# EasyEDA Pro project AC Power Switch.eprj, board Single Port PCB
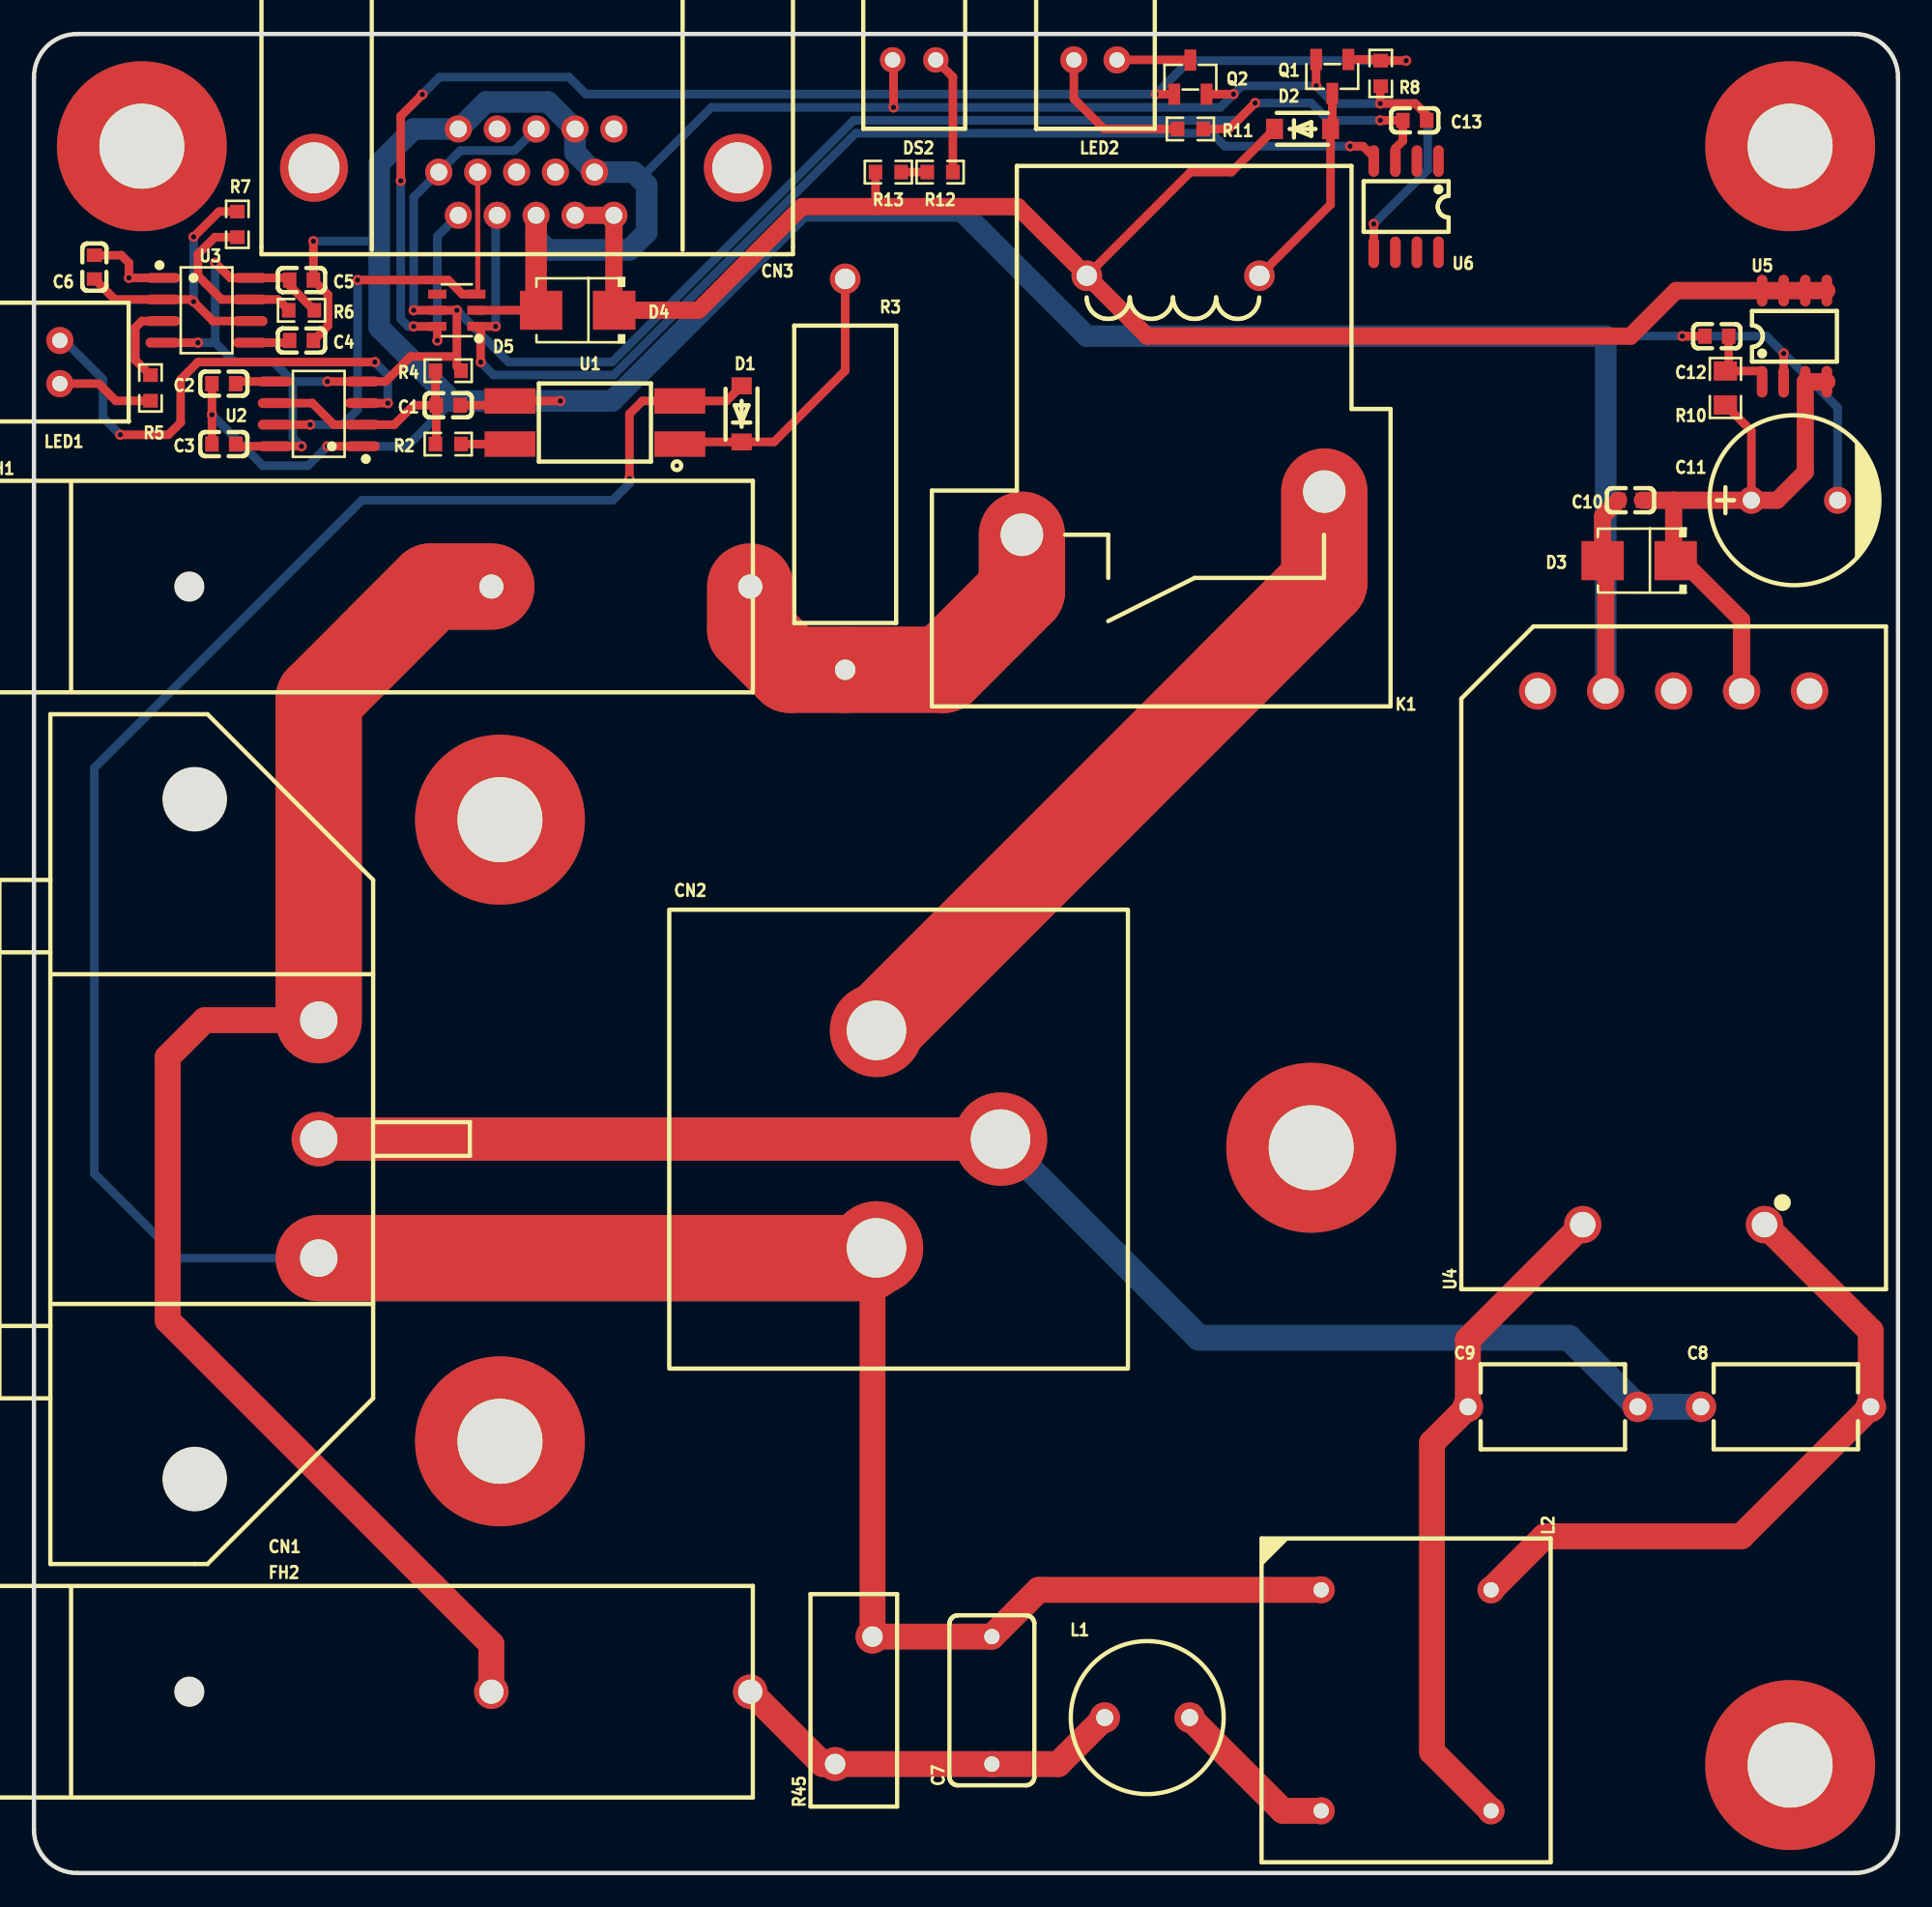
[diagram p5: board, top side]
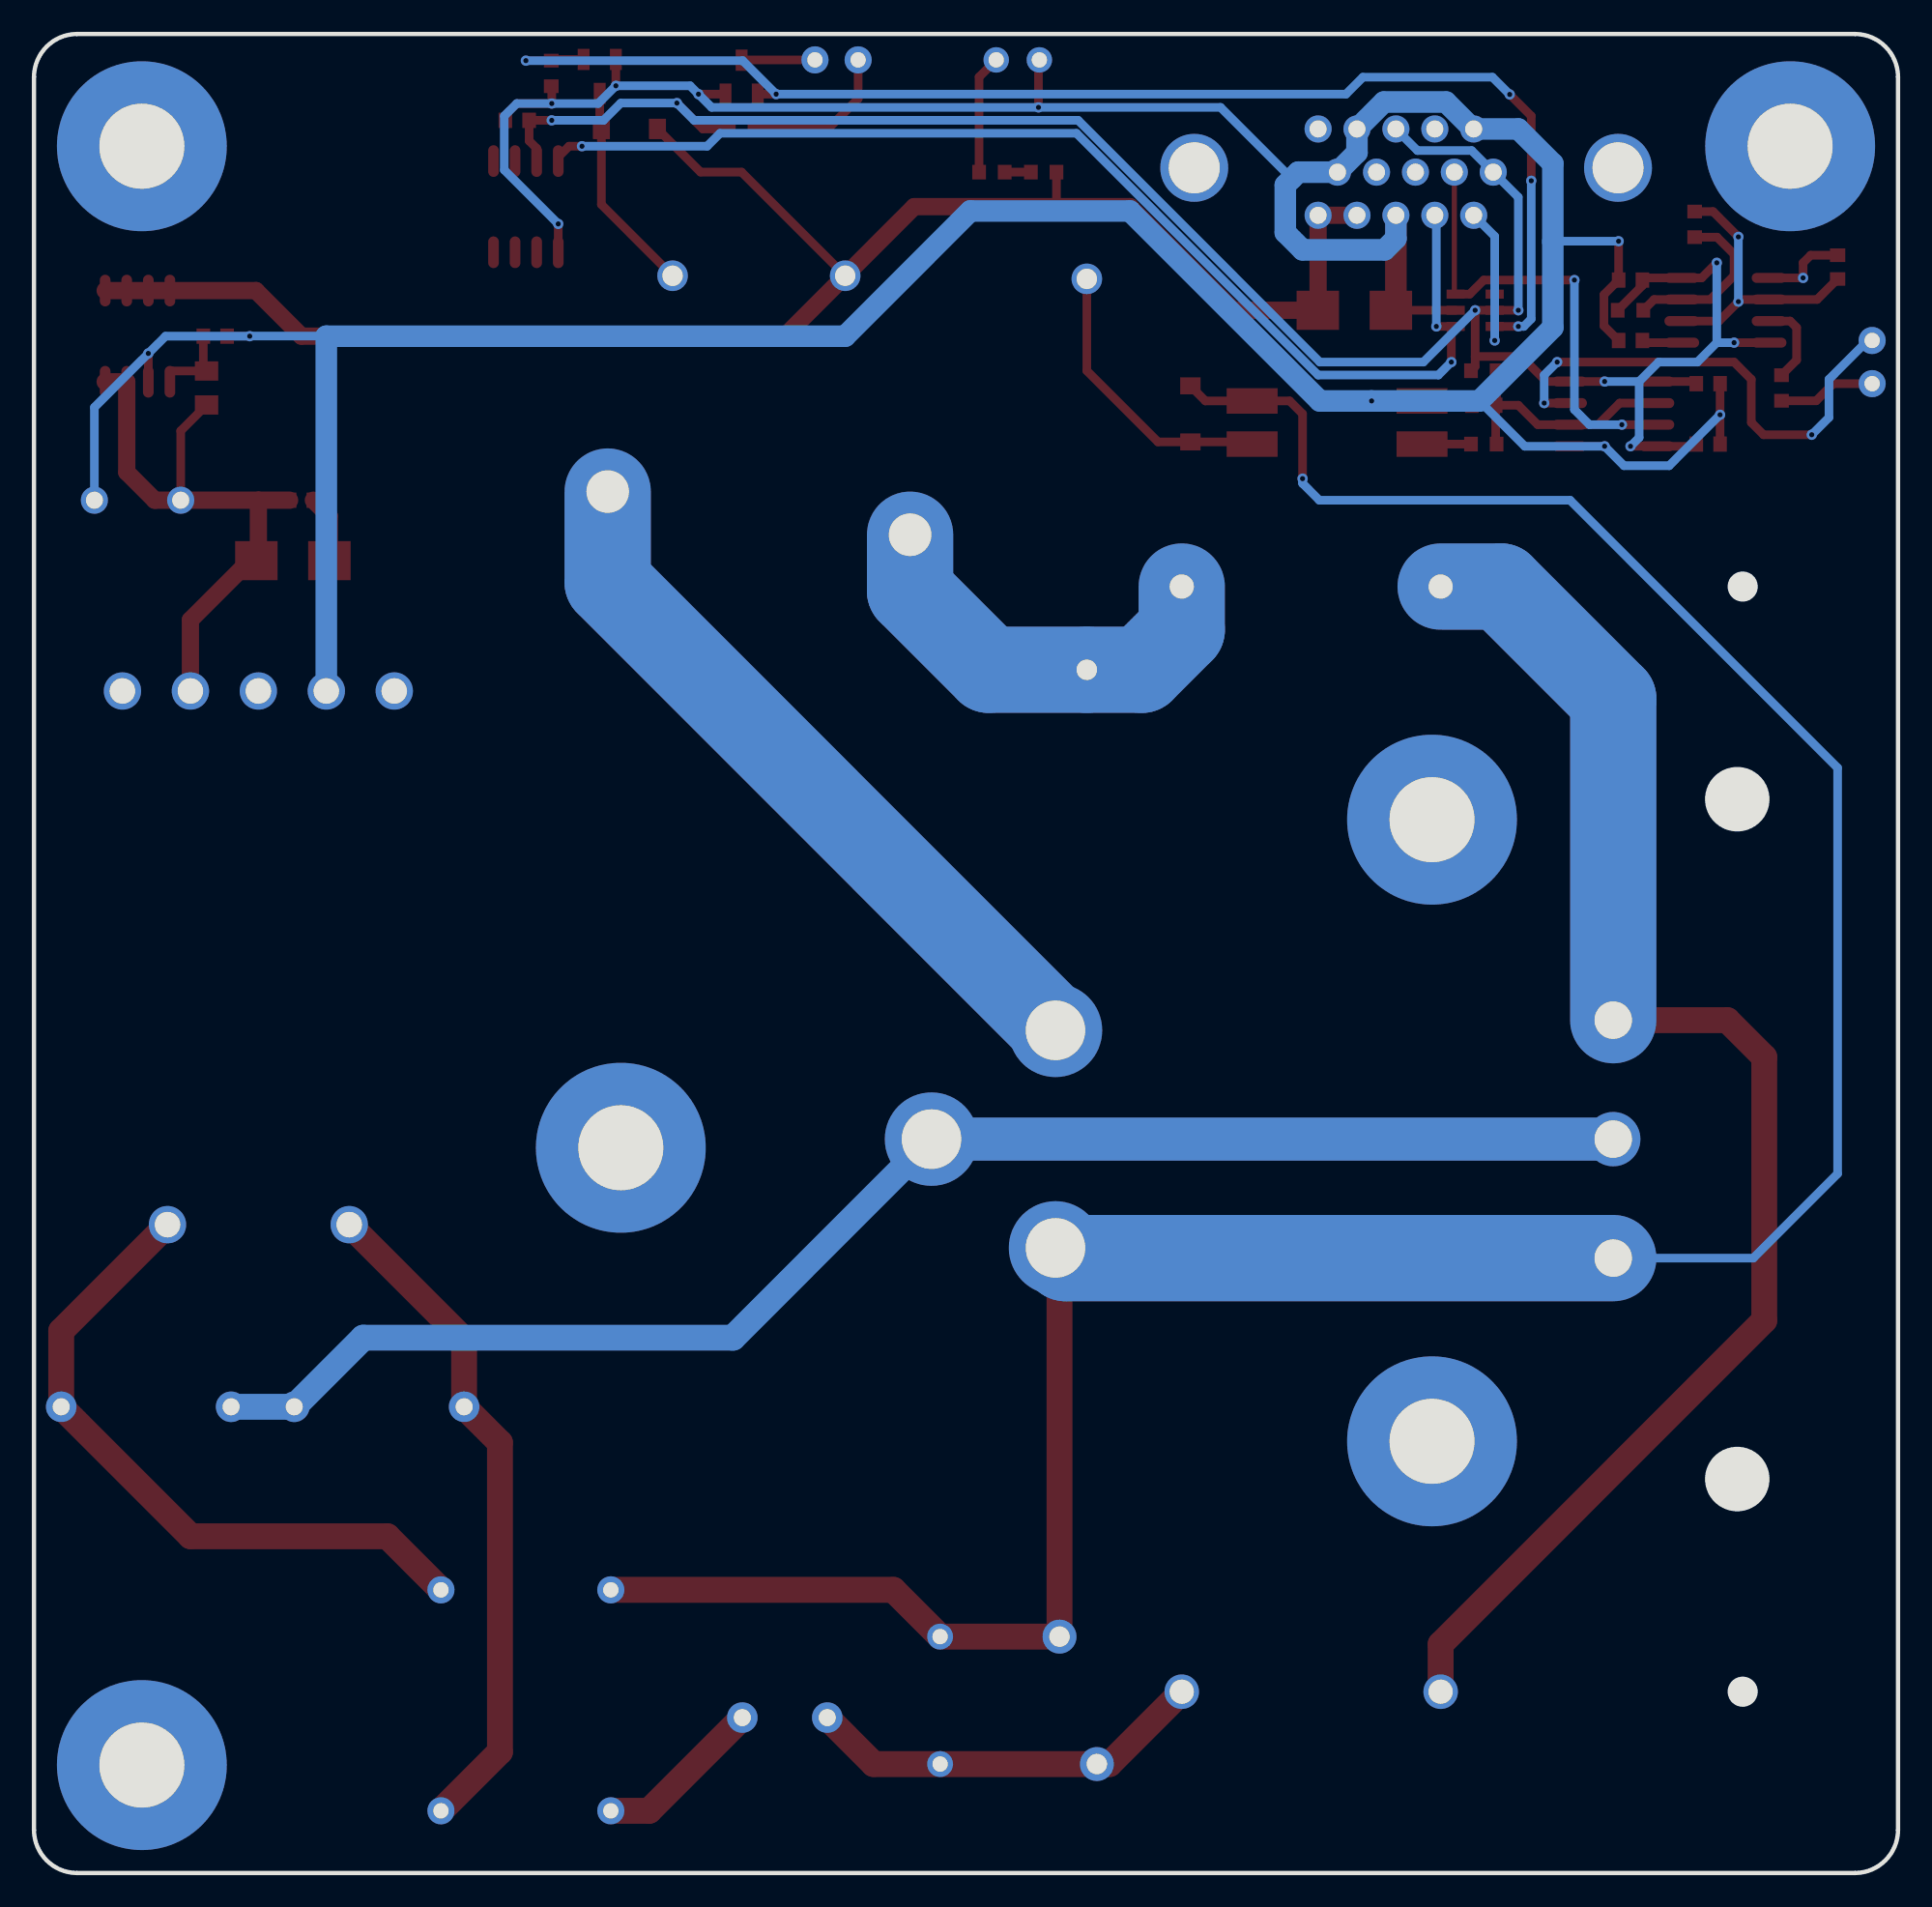
[diagram p6: board, bottom side, seen from below]

Outline 109.73 x 108.2 mm; copper layers: Top Layer, Bottom Layer. Coordinates in mm from the lower left corner of the outline.
Outline path: 0,105.66 0,2.54 arc(0.74,0.74) 2.54,0 107.19,0 arc(108.98,0.74) 109.73,2.54 109.73,105.66 arc(108.98,107.46) 107.19,108.2 2.54,108.2 arc(0.74,107.46) 0,105.66
Stack: Top Layer 0.035mm / Dielectric1 1.51mm FR4 er 4.5 / Bottom Layer 0.035mm

## Design rules (mm)
template: Custom Config
spacing copperThickness1oz (default): track to track 0.102, other pairs 0.152 to 0.3
spacing copperThickness2oz: track to track 0.203, other pairs 0.152 to 0.3
track width copperThickness1oz (default): min 0.127, default 0.254, max 7.62
track width copperThickness2oz: min 0.203, default 0.254, max 2.54
differential pair differentialPair (default): width min 0.127, default 0.254, max 2.54; gap min 0.152, default 0.152
via viaSize (default): diameter min 0.5, default 0.61, max 10; hole min 0.3, default 0.305, max 6.3

## Placement (name value [footprint] x y rotation side)
C1  10uF  [C0603]  24.38 86.36 180 top
C2  100nF  [C0603]  11.18 87.63 0 top
C3  100nF  [C0603]  11.18 84.07 0 top
C4  100nF  [C0603]  15.75 90.17 180 top
C5  100nF  [C0603]  15.75 93.73 180 top
C6  10uF  [C0603]  3.56 94.49 270 top
C7  100nF  [CAP-TH_L10.0-W5.0-P7.50-D0.6]  56.39 10.16 90 top
C8  1nF  [CAP-TH_L8.5-W5.0-P10.00-D0.6]  103.12 27.43 0 top
C9  1nF  [CAP-TH_L8.5-W5.0-P10.00-D0.6]  89.41 27.43 0 top
C10  1uF  [C0603]  93.98 80.77 0 top
C11  470uF  [CAP-TH_BD10.0-P5.00-D1.0-FD]  103.63 80.77 0 top
C12  100nF  [C0603]  99.06 90.42 0 top
C13  100nF  [C0603]  81.28 103.12 180 top
CN1  IEC-EW-4  [CONN-TH_IEC-EW-4]  16.76 43.18 90 top
CN2  a5006310303c48c0bbc049ad0b759426  [739W-X2/32]  56.9 43.18 270 top
CN3  DS1038-15FBNSiA74-0CC  [DSUB-TH_DS1038-15FBNSIA74-0CC]  28.96 100.08 180 top
D1  SM4007PL  [SOD-123F_L2.8-W1.8-LS3.7-RD]  41.66 85.85 90 top
D2  SM4007PL  [SOD-123F_L2.8-W1.8-LS3.7-RD]  74.68 102.62 0 top
D3  SMBJ15A  [SMB_L4.3-W3.6-LS5.3-RD]  94.49 77.22 180 top
D4  SMBJ15A  [SMB_L4.3-W3.6-LS5.3-RD]  32 91.95 180 top
D5  SRV05-4A  [SOT-23-6_L2.9-W1.6-P0.95-LS2.9-BL]  24.89 91.95 90 top
DS2  MHK1560UGBTD  [LED-TH_MHK1560UGBTD]  51.82 106.68 180 top
FH1  -  [03450101H]  34.54 75.69 0 top
FH2  -  [03450101H]  34.54 10.67 0 top
K1  HF2150-1A-12DE  [RELAY-TH_HF2150-1A]  67.06 86.36 180 top
L1  470uH  [IND-TH_BD9.0-P5.00-D0.7]  65.53 9.14 0 top
L2  YDUU10.5-253L0321  [IND-TH_4P-L19.0-W17.0]  80.77 10.16 270 top
LED1  MHK1560CRBTD  [LED-TH_L12.2-W6.0-P2.54]  1.52 88.9 270 top
LED2  MHK1560CRBTD  [LED-TH_L12.2-W6.0-P2.54]  62.48 106.68 180 top
NOREF  -  [Pad_e54]  103.38 101.6 0 top
NOREF#2  -  [Pad_e58]  75.18 42.67 0 top
NOREF#3  -  [Pad_e52]  27.43 25.4 0 top
NOREF#4  -  [Pad_e48]  103.38 6.35 0 top
NOREF#5  -  [Pad_e246]  6.35 101.6 0 top
NOREF#6  -  [Pad_e53]  27.43 61.98 0 top
Q1  AO3400A  [SOT-23-3_L2.9-W1.3-P1.90-LS2.4-BR]  76.42 105.71 90 top
Q2  AO3400A  [SOT-23-3_L2.9-W1.3-P1.90-LS2.4-BR]  68.07 105.66 270 top
R2  100Ω  [R0603]  24.38 84.07 180 top
R3  33kΩ  [RES-TH_BD6.0-L17.5-P21.50-D0.8]  47.75 82.3 270 top
R4  4.7kΩ  [R0603]  24.38 88.39 0 top
R5  1kΩ  [R0603]  6.86 87.38 90 top
R6  10kΩ  [R0603]  15.75 91.95 0 top
R7  20kΩ  [R0603]  11.97 97 270 top
R8  10kΩ  [R0603]  79.28 105.88 90 top
R10  390Ω  [R0805]  99.57 87.38 270 top
R11  1kΩ  [R0603]  68.07 102.62 0 top
R12  1kΩ  [R0603]  53.34 100.08 0 top
R13  1kΩ  [R0603]  50.29 100.08 0 top
R45  210pF@1kHz  [RES-TH_L12.5-W5.1-P7.50-D1.2-S2.20]  48.26 10.16 90 top
U1  LTV-817S-TA1-C  [OPTO-SMD-4_L4.6-W6.5-P2.54-LS10.3-BL]  33.02 85.34 90 top
U2  NE555DR  [SOIC-8_L4.9-W3.9-P1.27-LS6.0-BL]  16.76 85.85 90 top
U3  NE555DR  [SOIC-8_L4.9-W3.9-P1.27-LS6.0-BL]  10.16 91.95 270 top
U4  TAS20-12-W2  [PWRM-TH_4P-L39.0-W25.0_TAS12-15-W2]  96.52 53.85 90 top
U5  MX5052S  [SOP-8_L4.9-W3.9-P1.27-LS6.0-BL]  103.63 90.42 0 top
U6  DS18B20Z(UMW)  [SOP-8_L4.9-W3.9-P1.27-LS6.0-BL]  80.77 98.04 180 top

## Footprints (pads in the part's own frame, mm; a bottom-side part is the same pattern mirrored in y, then rotated)
739W-X2/32
  round 5.5 hole 3.5: 1(6.4,-7.3) 2(-6.4,-7.3) 3(0,0)
03450101H
  round 2.032 hole 1.423: 1(7.62,0) 2(-7.62,0)
C0603
  rect 0.8x0.9 smd: 1(-0.7,0) 2(0.7,0)
CAP-TH_BD10.0-P5.00-D1.0-FD
  round 1.6 hole 1: 1(-2.54,0) 2(2.54,0)
CAP-TH_L8.5-W5.0-P10.00-D0.6
  round 1.8 hole 1: 1(-5,0) 2(5,0)
CAP-TH_L10.0-W5.0-P7.50-D0.6
  round 1.524 hole 0.9: 1(-3.75,0) 2(3.75,0)
CONN-TH_IEC-EW-4
  round 3.2 hole 2.2: 1(-7,0) 2(0,0) 3(7,0)
DSUB-TH_DS1038-15FBNSIA74-0CC
  round 1.6 hole 1: 1(3.978,2.54) 2(1.688,2.54) 3(-0.603,2.54) 4(-2.893,2.54) 5(-5.182,2.54) 6(5.128,0) 7(2.837,0) 8(0.548,0) 9(-1.743,0) 10(-4.042,0) 11(3.978,-2.54) 12(1.688,-2.54) 13(-0.603,-2.54) 14(-2.893,-2.54) 15(-5.182,-2.54)
  round 4 hole 3: 16(12.473,-0.254) 17(-12.473,-0.254)
IND-TH_4P-L19.0-W17.0
  round 1.6 hole 0.9: 1(-6.5,-5) 2(6.5,-5) 3(-6.5,5) 4(6.5,5)
IND-TH_BD9.0-P5.00-D0.7
  round 1.8 hole 1: 1(-2.5,0) 2(2.5,0)
LED-TH_L12.2-W6.0-P2.54
  round 1.6 hole 0.9: 1(-1.27,0) 2(1.27,0)
LED-TH_MHK1560UGBTD
  round 1.5 hole 0.9: 1(1.27,0) 2(-1.27,0)
OPTO-SMD-4_L4.6-W6.5-P2.54-LS10.3-BL
  rect 1.5x3 smd: 1(-1.27,-5) 2(1.27,-5) 3(1.27,5) 4(-1.27,5)
Pad_e48
  round 10 hole 5: 1(0,0)
Pad_e52
  round 10 hole 5: 1(0,0)
Pad_e53
  round 10 hole 5: 1(0,0)
Pad_e54
  round 10 hole 5: 1(0,0)
Pad_e58
  round 10 hole 5: 1(0,0)
Pad_e246
  round 10 hole 5: 1(0,0)
PWRM-TH_4P-L39.0-W25.0_TAS12-15-W2
  round 2.2 hole 1.5: 1(-15.7,-5.35) 2(-15.7,5.35) 3(15.7,8) 4(15.7,4) 5(15.7,0) 6(15.7,-4) 7(15.7,-8)
R0603
  rect 0.806x0.864 smd: 1(-0.753,0) 2(0.753,0)
R0805
  rect 1.133x1.377 smd: 1(-1,0) 2(1,0)
RELAY-TH_HF2150-1A
  round 1.8 hole 1.2: 1(-5.08,-7.62) 2(5.08,-7.62)
  round 3.5 hole 2.5: 3(8.9,7.62) 4(-8.9,5.08)
RES-TH_BD6.0-L17.5-P21.50-D0.8
  round 1.8 hole 1.2: 1(-11.5,0) 2(11.5,0)
RES-TH_L12.5-W5.1-P7.50-D1.2-S2.20
  round 2 hole 1.2: 1(-3.749,1.1) 2(3.749,-1.1)
SMB_L4.3-W3.6-LS5.3-RD
  rect 2.5x2.3 smd: 1(-2.15,0) 2(2.15,0)
SOD-123F_L2.8-W1.8-LS3.7-RD
  rect 1x1.2 smd: 1(-1.65,0) 2(1.65,0)
SOIC-8_L4.9-W3.9-P1.27-LS6.0-BL
  oval 0.588x2.045 smd: 1(-1.905,-2.57) 2(-0.635,-2.57) 3(0.635,-2.57) 4(1.905,-2.57) 5(1.905,2.57) 6(0.635,2.57) 7(-0.635,2.57) 8(-1.905,2.57)
SOP-8_L4.9-W3.9-P1.27-LS6.0-BL
  oval 0.63x1.865 smd: 1(-1.905,-2.683) 2(-0.635,-2.683) 3(0.635,-2.683) 4(1.905,-2.683) 5(1.905,2.683) 6(0.635,2.683) 7(-0.635,2.683) 8(-1.905,2.683)
SOT-23-3_L2.9-W1.3-P1.90-LS2.4-BR
  rect 1.25x0.7 smd: 1(1,-0.95) 2(1,0.95) 3(-1,0)
SOT-23-6_L2.9-W1.6-P0.95-LS2.9-BL
  rect 0.532x1.072 smd: 1(-0.95,-1.149) 2(0,-1.149) 3(0.95,-1.149) 4(0.95,1.149) 5(0,1.149) 6(-0.95,1.149)

## Nets
As in the schematic.

Pads without a net: CN3 8 9 12 15 16 17; D5 4; NOREF 1; NOREF#2 1; NOREF#3 1; NOREF#4 1; NOREF#5 1; NOREF#6 1; U4 3 5 7; U6 1 2 6 7 8

## Via types
v1: diameter 0.61, hole 0.305, Top Layer to Bottom Layer, 37 vias

## Routing (per net, layer and track width the routed paths; a pad name or vN(x,y) marks a point on that pad's centre or on a via; arc(x,y) is an arc through that point)
+5V: length 130.2
  Top Layer w0.508: v1(10.67,94.74) 11.56,93.85 U3.8 14.92,93.85 C5.2 15.05,93.4 R6.2 ; v1(15.75,83.95) U2.8 12,83.95 ; v1(79.25,103.12) C13.2 80.58,101.92 80.14,101.47 80.14,100.73 ; R4.2 24.89,88.64 24.89,89.23 ; R11.2 70.36,102.62 v1(71.88,104.14) ; 24.89,89.23 22.17,89.23 20.7,87.76 U2.4 v1(17.27,87.76) ; 24.89,89.23 v1(24.89,91.95) D5.5 v1(22.35,91.95) ; U3.4 v1(9.65,90.04)
  Bottom Layer w0.508: v1(79.25,103.12) 76.2,103.12 75.18,104.14 v1(71.88,104.14) 70.87,103.12 48.26,103.12 34.04,88.9 27.94,88.9 v1(24.89,91.95) ; 15.24,87.76 15.24,84.45 v1(15.75,83.95) ; 15.24,87.76 v1(17.27,87.76) ; 15.24,87.76 14.1,88.9 11.81,88.9 10.67,90.04 ; v1(22.35,91.95) 22.35,98.6 CN3.6 25.1,101.35 28.29,101.35 CN3.13 ; v1(9.65,90.04) 10.67,90.04 ; 10.67,90.04 v1(10.67,94.74)
+12V: length 102
  Top Layer w0.508: 49.61,98.04 49.54,98.11 R13.1 ; K1.2 68.07,100.08 70.49,100.08 D2.1
  Top Layer w1.016: CN3.4 CN3.5 34.14,92.73 34.15,92.71 ; D4.1 39.12,91.95 45.21,98.04 57.91,98.04 K1.2 65.53,90.42 93.98,90.42 96.66,93.11 U5.8 U5.7 U5.5
GND: length 302
  Top Layer w0.508: U2.1 v1(17.27,83.95) ; 29.85,91.56 29.46,91.95 D5.2 ; v1(30.99,86.61) U1.3 27.77,86.36 C1.1 ; C2.1 v1(10.48,85.8) C3.1 ; C6.1 5.14,95.19 5.59,94.74 v1(5.59,93.85) U3.1 ; C13.1 81.98,103.44 81.31,104.11 v1(79.25,104.11) 79.25,105.1 R8.1 ; C12.1 v1(97.03,90.42) ; C4.1 17.31,91.03 17.31,92.86 C5.1 v1(16.45,96.01) ; Q1.2 v1(75.47,105.16) ; U5.2 v1(103,89.41) ; Q2.2 v1(70.61,104.66) ; v1(50.6,103.89) 50.6,106.63 DS2.1 ; U6.5 v1(78.87,97.03)
  Top Layer w1.016: D3.2 92.34,79.83 C10.1 ; 92.08,76.96 91.83,77.22 ; U4.4 92.52,76.53
  Top Layer w1.27: 29.85,91.56 D4.2 ; CN3.3 29.56,91.85
  Bottom Layer w0.508: v1(16.45,96.01) 20.3,96.01 20.32,95.99 ; 92.52,90.42 92.53,90.43 97.02,90.43 v1(97.03,90.42) 101.98,90.42 v1(103,89.41) 106.17,86.23 C11.2 ; 35.69,99.69 39.88,103.89 v1(50.6,103.89) 69.83,103.89 v1(70.61,104.66) 71.1,105.16 v1(75.47,105.16) 76.52,104.11 v1(79.25,104.11) 81.31,104.11 82.04,103.38 82.04,100.2 v1(78.87,97.03) ; 24.64,86.61 21.97,83.95 v1(17.27,83.95) 16.13,82.8 13.47,82.8 v1(10.48,85.8)
  Bottom Layer w1.27: CN3.3 29.56,96.17 30.23,95.5 35.05,95.5 36.07,96.52 36.07,99.31 35.31,100.08 CN3.10 31.85,101.22 CN3.14 30.26,104.2 26.61,104.2 25.02,102.62 CN3.11 22.35,102.62 20.32,100.58 20.32,90.93 24.64,86.61 v1(30.99,86.61) 34.04,86.61 45.21,97.79 54.61,97.79 61.98,90.42 92.52,90.42 U4.4
ACCESS: length 88.8
  Top Layer w0.508: Q2.1 v1(66.04,104.66) ; Q1.1 79.21,106.71 R8.2 v1(80.77,106.64) ; v1(22.35,91) D5.6 v1(23.74,90.17) ; v1(22.86,104.65) 21.59,103.38 v1(21.59,99.57)
  Bottom Layer w0.508: v1(21.59,99.57) 21.59,91.44 22.03,91 v1(22.35,91) ; CN3.1 23.74,96.3 v1(23.74,90.17) ; v1(22.86,104.65) 23.88,105.66 31.5,105.66 32.5,104.66 v1(66.04,104.66) 68.01,106.64 v1(80.77,106.64)
EARTH: length 128
  Top Layer w2.54: CN2.3 CN1.2
  Bottom Layer w1.524: CN2.3 68.58,31.5 90.34,31.5 C9.2 C8.1
  Bottom Layer w2.54: CN2.3 CN1.2
FUSEDET: length 49.5
  Top Layer w5.08: K1.3 58.16,75.43 53.52,70.8 R3.2 44.52,70.8 42.16,73.15 FH1.1
  Bottom Layer w5.08: FH1.1 42.16,73.15 44.52,70.8 R3.2 53.52,70.8 58.16,75.43 K1.3
INTERRUPT: length 27.4
  Top Layer w0.305: CN3.7 26.12,92.98 D5.3
  Top Layer w0.508: U2.7 v1(16.26,85.22) ; v1(19.05,93.73) 24.38,93.73 25.21,92.9 D5.3
  Bottom Layer w0.508: v1(19.05,93.73) 19.05,86.11 18.16,85.22 v1(16.26,85.22)
LIVE: length 118.6
  Top Layer w1.524: FH2.2 26.92,13.46 7.87,32.51 7.87,48.01 10.05,50.18 CN1.3
  Top Layer w5.08: CN1.3 16.76,69.09 23.37,75.69 FH1.2
  Bottom Layer w5.08: FH1.2 23.37,75.69 16.76,69.09 CN1.3
NEUTRAL: length 205.2
  Top Layer w0.508: D1.2 40.77,86.61 U1.2 35.81,86.61 35.05,85.85 v1(35.05,82.04)
  Top Layer w1.524: 49.36,13.91 C7.2 59.14,16.66 L2.1 ; 49.27,36.46 49.36,36.37 R45.2
  Top Layer w5.08: CN1.1 49,36.18 CN2.1
  Bottom Layer w0.508: v1(35.05,82.04) 35.05,81.76 34.06,80.77 19.3,80.77 3.56,65.02 3.56,41.15 8.52,36.18 CN1.1
  Bottom Layer w5.08: CN2.1 49,36.18 CN1.1
ONEWIRE: length 69.5
  Top Layer w0.508: U6.4 78.87,100.96 78.23,101.6 v1(77.47,101.6) ; v1(27.18,91) D5.1 26.3,90.74 v1(26.3,88.9)
  Bottom Layer w0.508: CN3.2 27.18,97.45 v1(27.18,91) ; v1(77.47,101.6) 70.1,101.6 69.34,102.36 48.36,102.36 34.14,88.14 27.06,88.14 v1(26.3,88.9)
$1N351: length 85.2
  Top Layer w5.08: K1.4 75.96,75.94 CN2.2
  Bottom Layer w5.08: K1.4 75.96,75.94 CN2.2
$1N604: length 16.9
  Top Layer w0.508: U1.1 38.15,84.2 D1.1 43.56,84.2 47.75,88.39 R3.1
$1N729: length 2.9
  Top Layer w0.508: R2.1 U1.4
$1N819: length 14.8
  Top Layer w0.508: R4.1 23.63,86.41 ; 23.63,86.41 23.58,86.36 22.35,86.36 21.21,85.22 U2.2 17.65,85.22 16.38,86.49 U2.6 ; 23.63,86.41 C1.2 23.68,84.13 R2.2
$1N1030: length 2.4
  Top Layer w0.508: U2.5 12,87.76 C2.2
$1N1211: length 5.8
  Top Layer w0.508: R5.1 4.82,86.62 3.81,87.63 LED1.2
$1N1254: length 29.6
  Top Layer w0.508: v1(5.08,84.63) 7.92,84.63 8.64,85.34 8.64,87.88 9.65,88.9 v1(20.07,88.9) ; U2.3 v1(20.83,86.49)
  Bottom Layer w0.508: LED1.1 1.78,90.17 4.06,87.88 4.06,85.64 v1(5.08,84.63) ; v1(20.83,86.49) 20.83,88.14 v1(20.07,88.9)
$1N1384: length 4.9
  Top Layer w0.508: U3.3 6.35,91.31 5.97,90.93 5.97,89.02 R5.2
$1N1437: length 2.4
  Top Layer w0.508: C4.2 14.92,90.04 U3.5
$1N1554: length 17.2
  Top Layer w0.508: U3.6 10.54,91.31 v1(9.4,92.46) 9.27,92.58 U3.2 4.76,92.58 C6.2 ; v1(9.4,96.27) 10.89,97.76 R7.1
  Bottom Layer w0.508: v1(9.4,96.27) v1(9.4,92.46)
$1N1596: length 10.2
  Top Layer w0.508: R7.2 10.65,96.25 9.65,95.25 9.65,93.98 11.05,92.58 U3.7 14.36,92.58 R6.1
$1N1792: length 12.5
  Top Layer w0.508: Q1.3 76.42,102.71 D2.2 76.33,98.17 K1.1
$1N2996: length 23.8
  Top Layer w1.524: FH2.1 46.42,6.41 R45.1 ; L1.1 60.3,6.41 C7.1 47.16,6.41
$1N3019: length 10
  Top Layer w1.524: L2.2 73.52,3.66 L1.2
$1N3074: length 39.6
  Top Layer w1.524: L2.4 82.3,7.14 82.3,25.32 C9.1 84.41,31.39 U4.2
$1N3080: length 40.1
  Top Layer w1.524: L2.3 88.92,19.81 100.5,19.81 C8.2 108.12,31.89 U4.1
$1N3148: length 36.9
  Top Layer w0.508: C11.1 101.09,84.85 R10.2
  Top Layer w1.016: 96.77,77.22 97.03,77.22 100.52,73.72 U4.6 ; U5.4 104.27,87.74 104.27,82.42 102.62,80.77 C11.1 96.52,80.77 ; 96.52,80.77 C10.2 ; 96.52,80.77 96.52,77.22 ; 96.52,77.22 96.52,76.71 ; 96.52,77.22 96.13,77.22
$1N3585: length 4.9
  Top Layer w0.508: C12.2 99.76,88.57 R10.1 101.62,88.38 101.73,88.26 U5.1
$1N4288: length 9.1
  Top Layer w0.508: LED2.2 61.21,104.39 62.99,102.62 R11.1
$1N4366: length 7
  Top Layer w0.508: DS2.2 54.09,105.67 R12.2
$1N4486: length 4.3
  Top Layer w0.508: LED2.1 68.06,106.68 Q2.3
$1N10600: length 1.5
  Top Layer w0.508: R13.2 R12.1
